# EAGLE design openDrive_LM3S6965_00.01 (EAGLE 5.10)
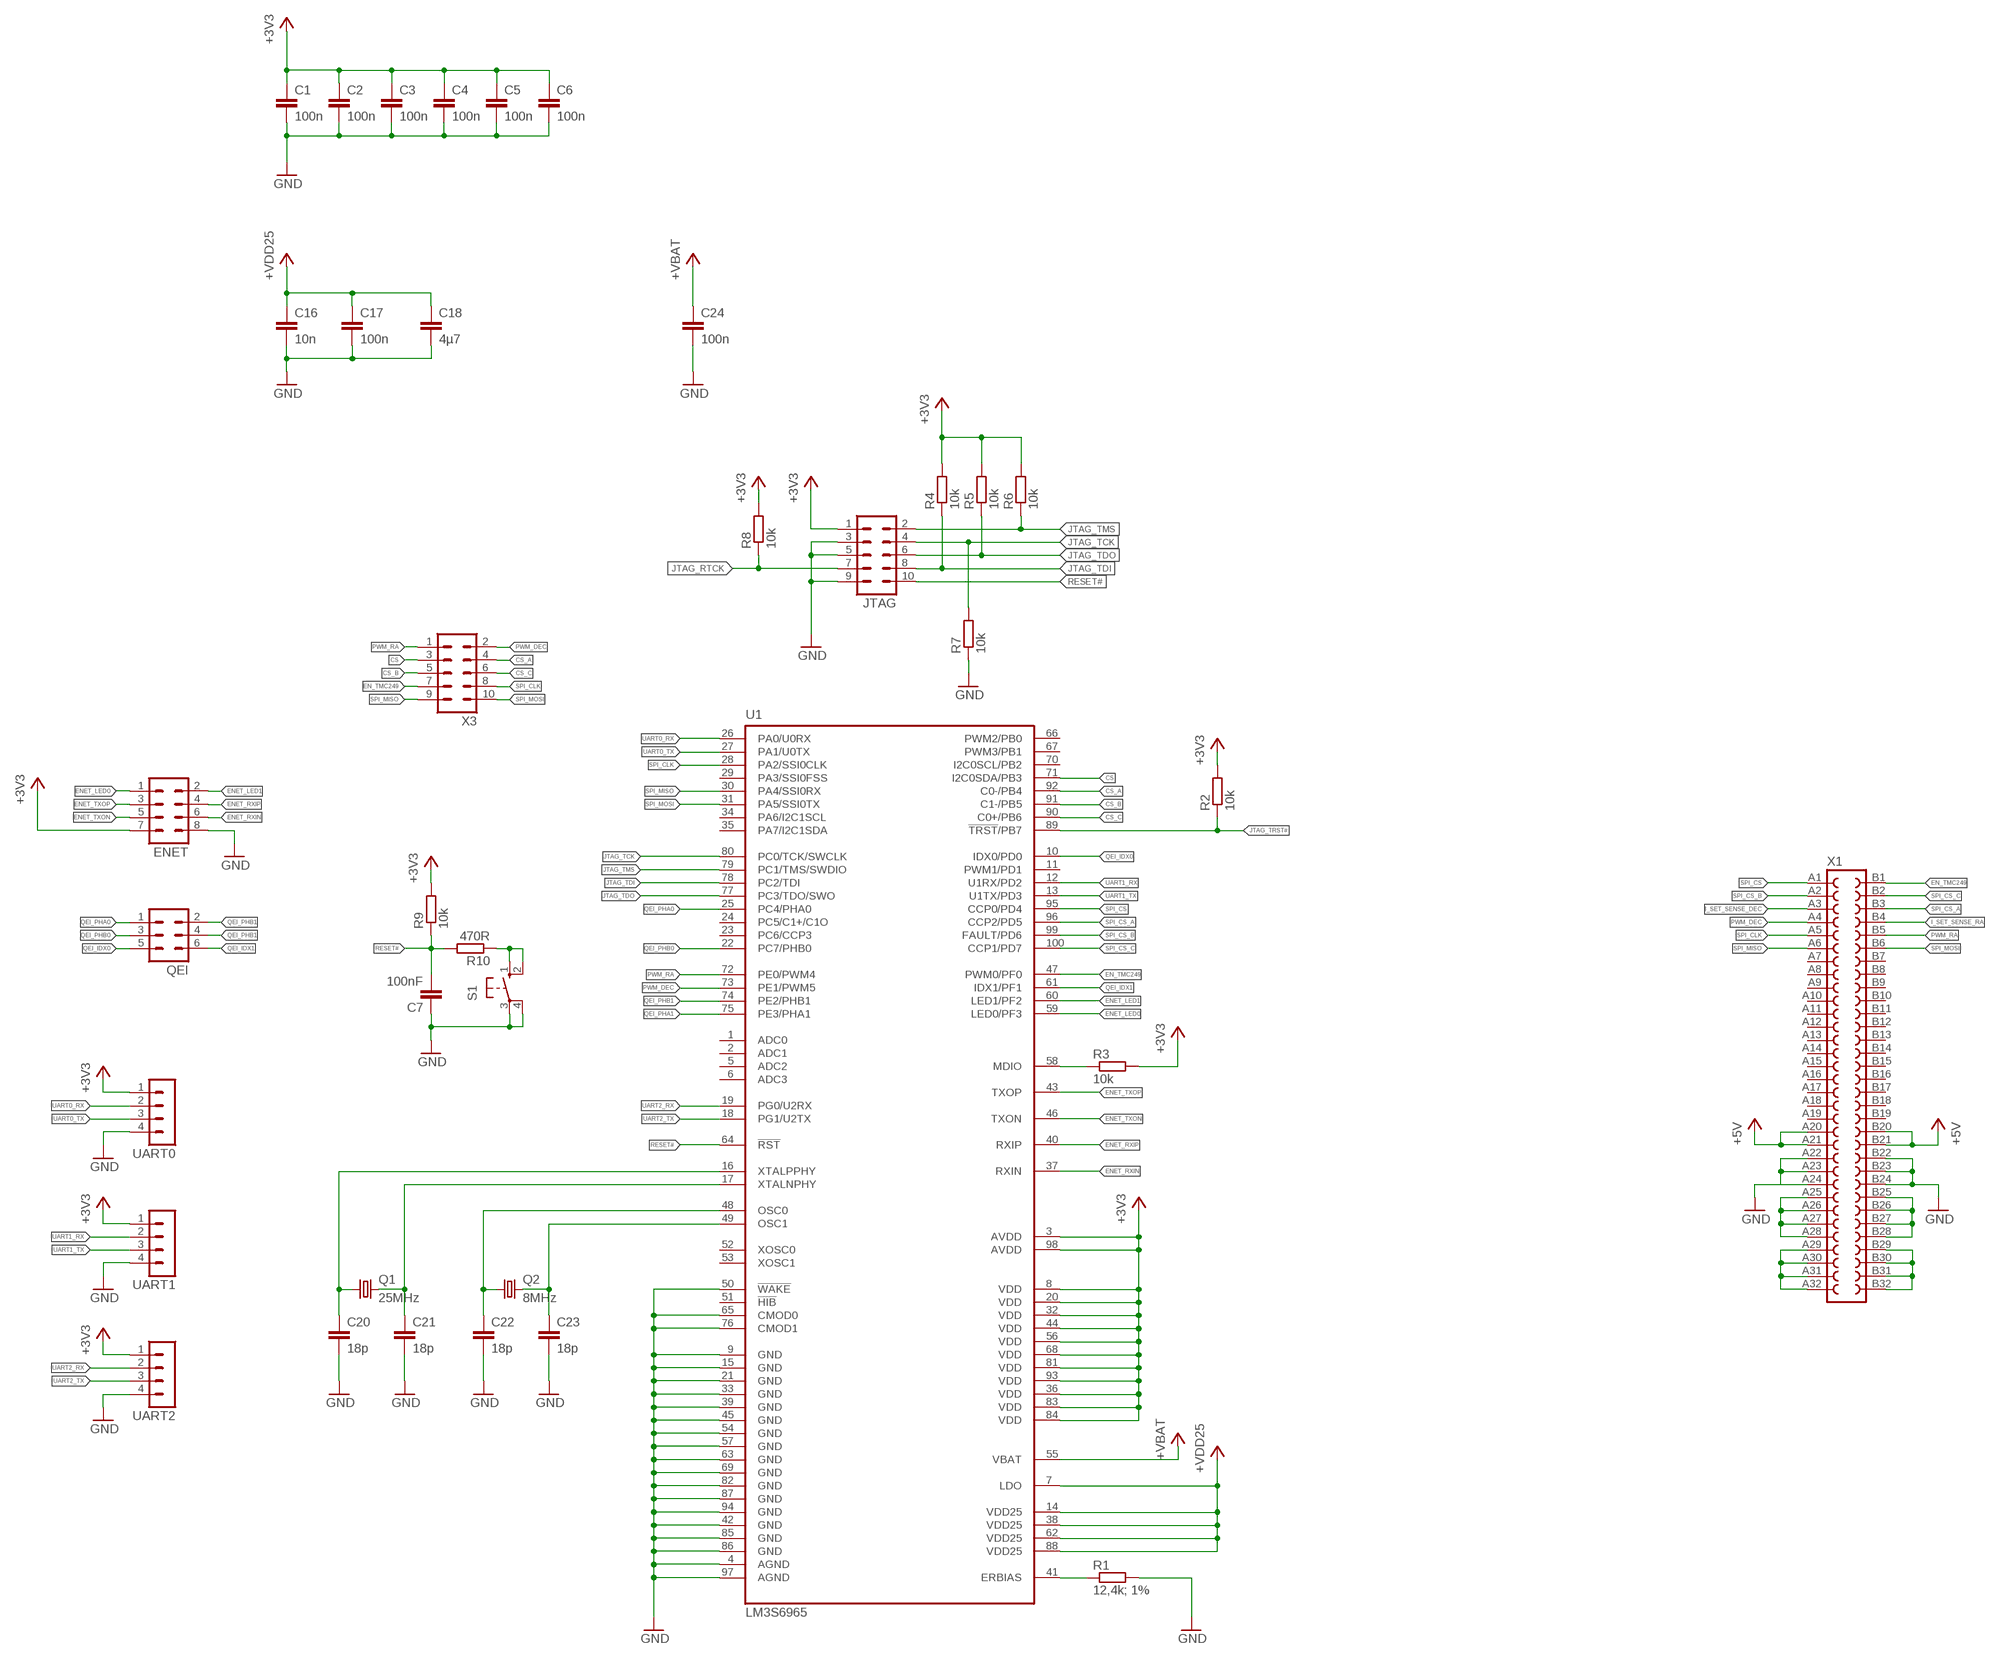
[diagram p0: schematic, sheet 1]

## Parts
C1  100n  C-EU025-025X050  [C025-025X050]
C2  100n  C-EU025-025X050  [C025-025X050]
C3  100n  C-EU025-025X050  [C025-025X050]
C4  100n  C-EU025-025X050  [C025-025X050]
C5  100n  C-EU025-025X050  [C025-025X050]
C6  100n  C-EU025-025X050  [C025-025X050]
C7  100nF  C-EU025-025X050  [C025-025X050]
C16  10n  C-EU025-025X050  [C025-025X050]
C17  100n  C-EU025-025X050  [C025-025X050]
C18  4µ7  C-EU025-025X050  [C025-025X050]
C20  18p  C-EU025-025X050  [C025-025X050]
C21  18p  C-EU025-025X050  [C025-025X050]
C22  18p  C-EU025-025X050  [C025-025X050]
C23  18p  C-EU025-025X050  [C025-025X050]
C24  100n  C-EU025-025X050  [C025-025X050]
ENET  MA04-2  [MA04-2]
JTAG  ML10  [ML10]
Q1  25MHz  CRYSTALHC49S  [HC49/S]
Q2  8MHz  CRYSTALHC49S  [HC49/S]
QEI  ML6  [ML6]
R1  12,4k; 1%  R-EU_0207/10  [0207/10]
R2  10k  R-EU_0207/10  [0207/10]
R3  10k  R-EU_0207/10  [0207/10]
R4  10k  R-EU_0207/10  [0207/10]
R5  10k  R-EU_0207/10  [0207/10]
R6  10k  R-EU_0207/10  [0207/10]
R7  10k  R-EU_0207/10  [0207/10]
R8  10k  R-EU_0207/10  [0207/10]
R9  10k  R-EU_0207/10  [0207/10]
R10  470R  R-EU_0207/10  [0207/10]
S1  10-XX  [B3F-10XX]
U1  LM3S6965  [LQFP100]
UART0  MA04-1  [MA04-1]
UART1  MA04-1  [MA04-1]
UART2  MA04-1  [MA04-1]
X1  FAB64S  [FAB64S]
X3  ML10  [ML10]

## Nets
+3V3: C1.1 C2.1 C3.1 C4.1 C5.1 C6.1 ENET.7 JTAG.1 R2.2 R3.2 R4.2 R5.2 R6.2 R8.2 R9.2 U1.3(AVDD) U1.8(VDD) U1.20(VDD) U1.32(VDD) U1.36(VDD) U1.44(VDD) U1.56(VDD) U1.68(VDD) U1.81(VDD) U1.83(VDD) U1.84(VDD) U1.93(VDD) U1.98(AVDD) UART0.1 UART1.1 UART2.1
+5V: X1.A20 X1.A21 X1.B20 X1.B21
+30V: X1.A29 X1.A30 X1.A31 X1.A32 X1.B29 X1.B30 X1.B31 X1.B32
+VBAT: C24.1 U1.55(VBAT)
+VDD25: C16.1 C17.1 C18.1 U1.7(LDO) U1.14(VDD25) U1.38(VDD25) U1.62(VDD25) U1.88(VDD25)
AGND: X1.A25 X1.A26 X1.A27 X1.A28 X1.B25 X1.B26 X1.B27 X1.B28
CS: U1.71(I2C0SDA/PB3) X3.3
CS_A: U1.92(C0-/PB4) X3.4
CS_B: U1.91(C1-/PB5) X3.5
CS_C: U1.90(C0+/PB6) X3.6
EN_TMC249: U1.47(PWM0/PF0) X1.B1 X3.7
ENET_LED0: ENET.1 U1.59(LED0/PF3)
ENET_LED1: ENET.2 U1.60(LED1/PF2)
ENET_RXIN: ENET.6 U1.37(RXIN)
ENET_RXIP: ENET.4 U1.40(RXIP)
ENET_TXON: ENET.5 U1.46(TXON)
ENET_TXOP: ENET.3 U1.43(TXOP)
GND: C1.2 C2.2 C3.2 C4.2 C5.2 C6.2 C7.1 C16.2 C17.2 C18.2 C20.2 C21.2 C22.2 C23.2 C24.2 ENET.8 JTAG.3 JTAG.5 JTAG.9 R1.2 R7.1 S1.3(P) S1.4(P1) U1.4(AGND) U1.9(GND) U1.15(GND) U1.21(GND) U1.33(GND) U1.39(GND) U1.42(GND) U1.45(GND) U1.50(!WAKE!) U1.54(GND) U1.57(GND) U1.63(GND) U1.65(CMOD0) U1.69(GND) U1.76(CMOD1) U1.82(GND) U1.85(GND) U1.86(GND) U1.87(GND) U1.94(GND) U1.97(AGND) UART0.4 UART1.4 UART2.4 X1.A22 X1.A23 X1.A24 X1.B22 X1.B23 X1.B24
I_SET_SENSE_DEC: X1.A3
I_SET_SENSE_RA: X1.B4
JTAG_RTCK: JTAG.7 R8.1
JTAG_TCK: JTAG.4 R7.2 U1.80(PC0/TCK/SWCLK)
JTAG_TDI: JTAG.8 R4.1 U1.78(PC2/TDI)
JTAG_TDO: JTAG.6 R5.1 U1.77(PC3/TDO/SWO)
JTAG_TMS: JTAG.2 R6.1 U1.79(PC1/TMS/SWDIO)
JTAG_TRST#: R2.1 U1.89(!TRST!/PB7)
N$1: C20.1 Q1.1 U1.16(XTALPPHY)
N$2: C21.1 Q1.2 U1.17(XTALNPHY)
N$3: C22.1 Q2.1 U1.48(OSC0)
N$4: C23.1 Q2.2 U1.49(OSC1)
N$5: R1.1 U1.41(ERBIAS)
N$6: R3.1 U1.58(MDIO)
N$7: R10.1 S1.1(S) S1.2(S1)
PWM_DEC: U1.73(PE1/PWM5) X1.A4 X3.2
PWM_RA: U1.72(PE0/PWM4) X1.B5 X3.1
QEI_IDX0: QEI.5 U1.10(IDX0/PD0)
QEI_IDX1: QEI.6 U1.61(IDX1/PF1)
QEI_PHA0: QEI.1 U1.25(PC4/PHA0)
QEI_PHA1: U1.75(PE3/PHA1)
QEI_PHB0: QEI.3 U1.22(PC7/PHB0)
QEI_PHB1: QEI.2 QEI.4 U1.74(PE2/PHB1)
RESET#: C7.2 JTAG.10 R9.1 R10.2 U1.64(!RST!)
SPI_CLK: U1.28(PA2/SSI0CLK) X1.A5 X3.8
SPI_CS: U1.95(CCP0/PD4) X1.A1
SPI_CS_A: U1.96(CCP2/PD5) X1.B3
SPI_CS_B: U1.99(FAULT/PD6) X1.A2
SPI_CS_C: U1.100(CCP1/PD7) X1.B2
SPI_MISO: U1.30(PA4/SSI0RX) X1.A6 X3.9
SPI_MOSI: U1.31(PA5/SSI0TX) X1.B6 X3.10
UART0_RX: U1.26(PA0/U0RX) UART0.2
UART0_TX: U1.27(PA1/U0TX) UART0.3
UART1_RX: U1.12(U1RX/PD2) UART1.2
UART1_TX: U1.13(U1TX/PD3) UART1.3
UART2_RX: U1.19(PG0/U2RX) UART2.2
UART2_TX: U1.18(PG1/U2TX) UART2.3
Unconnected: U1.1(ADC0) U1.2(ADC1) U1.5(ADC2) U1.6(ADC3) U1.11(PWM1/PD1) U1.23(PC6/CCP3) U1.24(PC5/C1+/C1O) U1.29(PA3/SSI0FSS) U1.34(PA6/I2C1SCL) U1.35(PA7/I2C1SDA) U1.51(!HIB!) U1.52(XOSC0) U1.53(XOSC1) U1.66(PWM2/PB0) U1.67(PWM3/PB1) U1.70(I2C0SCL/PB2) X1.A7 X1.A8 X1.A9 X1.A10 X1.A11 X1.A12 X1.A13 X1.A14 X1.A15 X1.A16 X1.A17 X1.A18 X1.A19 X1.B7 X1.B8 X1.B9 X1.B10 X1.B11 X1.B12 X1.B13 X1.B14 X1.B15 X1.B16 X1.B17 X1.B18 X1.B19

## Library data of the parts
C1-C7 C16-C18 C20-C24 = rcl:C-EU: CAPACITOR, European symbol
ENET = con-lstb:MA04-2: PIN HEADER
JTAG X3 = con-harting-ml:ML10: HARTING
Q1 Q2 = crystal:CRYSTAL: CRYSTAL
QEI = con-harting-ml:ML6: HARTING
R1-R10 = rcl:R-EU_: RESISTOR, European symbol
S1 = switch-omron:10-XX: OMRON SWITCH
U1 = luminary-arm:LM3S6965: MICROCONTROLLER
UART0 UART1 UART2 = con-lstb:MA04-1: PIN HEADER
X1 = con-vg:FAB64S: CONNECTOR female, 64 pins, block, type B, rows AB, grid 2.54 mm

## Board
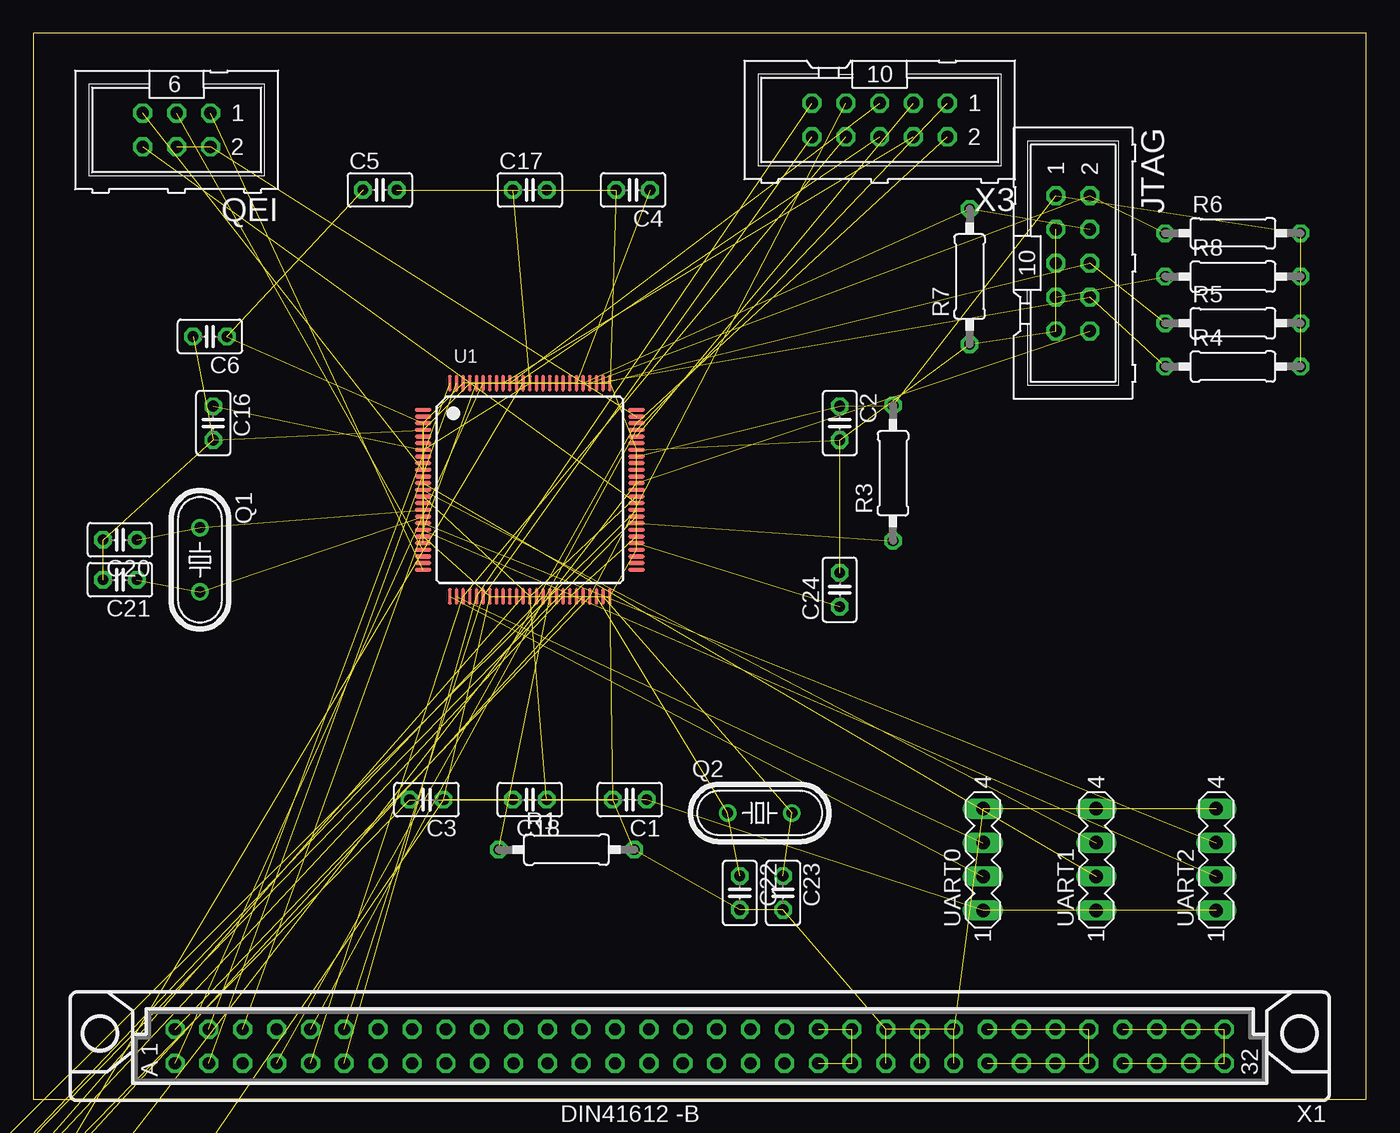
[diagram p1: board, top side]
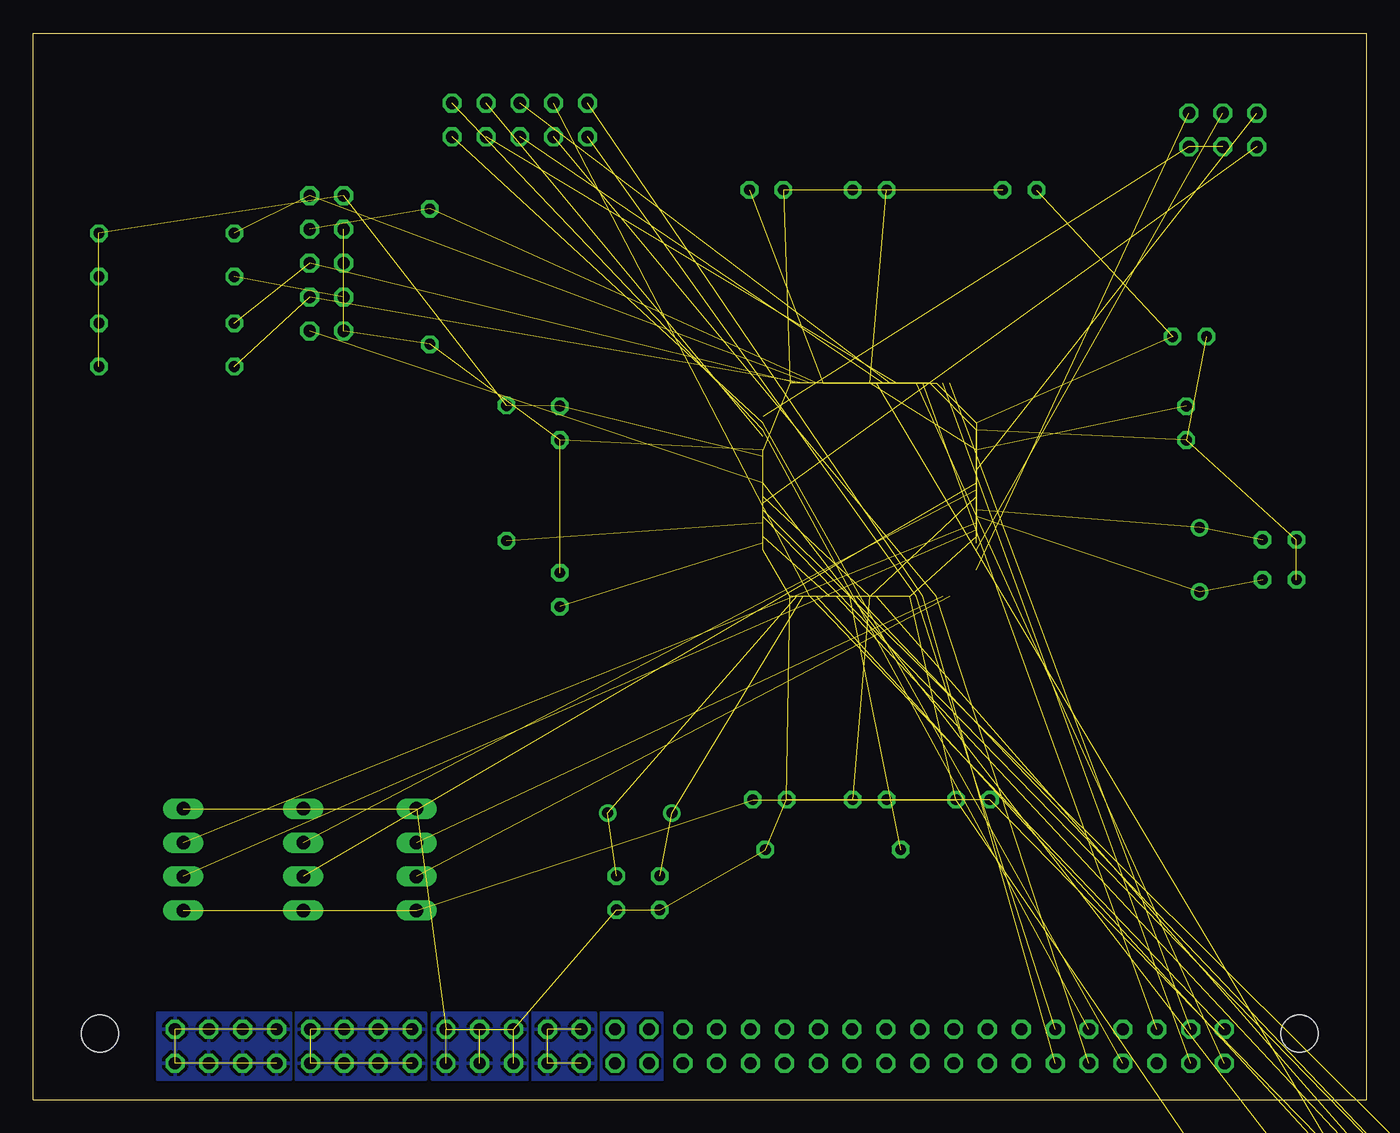
[diagram p2: board, bottom side, seen from below]

Size 100 x 80 mm. Coordinates in mm from the lower left corner, seen from the top.
Outline: 100,0 100,80 0,80 0,0 100,0
Copper layers (1*16): Top 0.035mm / dielectric 1.5mm / Bottom 0.035mm
Design rules "default": minimum track width 10mil, minimum drill 24mil, track to track 8mil, track to pad 8mil, pad to pad 8mil, via to via 8mil, smd to smd 8mil, copper to edge 40mil, drill to drill 8mil, minimum pad ring 10mil, minimum via ring 8mil, stop-mask expansion 4mil, vias tented up to drill 0mil, thermal gap 10mil

### Footprints (pad centres in the part's own frame; a part is rotated, then mirrored left to right if it is on the bottom)
C025-025X050 = drill 0.813 octagon: 1 -1.27,0; 2 1.27,0
MA04-2 = drill 1.016 octagon: 1 -3.81,-1.27; 2 -3.81,1.27; 3 -1.27,-1.27; 4 -1.27,1.27; 5 1.27,-1.27; 6 1.27,1.27; 7 3.81,-1.27; 8 3.81,1.27
ML10 = drill 0.914 octagon: 1 -5.08,-1.27; 2 -5.08,1.27; 3 -2.54,-1.27; 4 -2.54,1.27; 5 0,-1.27; 6 0,1.27; 7 2.54,-1.27; 8 2.54,1.27; 9 5.08,-1.27; 10 5.08,1.27
HC49/S = drill 0.813 round: 1 -2.413,0; 2 2.413,0
ML6 = drill 0.914 octagon: 1 -2.54,-1.27; 2 -2.54,1.27; 3 0,-1.27; 4 0,1.27; 5 2.54,-1.27; 6 2.54,1.27
0207/10 = drill 0.813 octagon: 1 -5.08,0; 2 5.08,0
B3F-10XX = drill 1.016 long: 1 -3.251,2.261; 2 3.251,2.261; 3 -3.251,-2.261; 4 3.251,-2.261
LQFP100 = smd 0.3 x 1.25: 1 -6,-8; 2 -5.5,-8; 3 -5,-8; 4 -4.5,-8; 5 -4,-8; 6 -3.5,-8; 7 -3,-8; 8 -2.5,-8; 9 -2,-8; 10 -1.5,-8; 11 -1,-8; 12 -0.5,-8; 13 0,-8; 14 0.5,-8; 15 1,-8; 16 1.5,-8; 17 2,-8; 18 2.5,-8; 19 3,-8; 20 3.5,-8; 21 4,-8; 22 4.5,-8; 23 5,-8; 24 5.5,-8; 25 6,-8; 51 6,8; 52 5.5,8; 53 5,8; 54 4.5,8; 55 4,8; 56 3.5,8; 57 3,8; 58 2.5,8; 59 2,8; 60 1.5,8; 61 1,8; 62 0.5,8; 63 0,8; 64 -0.5,8; 65 -1,8; 66 -1.5,8; 67 -2,8; 68 -2.5,8; 69 -3,8; 70 -3.5,8; 71 -4,8; 72 -4.5,8; 73 -5,8; 74 -5.5,8; 75 -6,8 | smd 1.25 x 0.3: 26 8,-6; 27 8,-5.5; 28 8,-5; 29 8,-4.5; 30 8,-4; 31 8,-3.5; 32 8,-3; 33 8,-2.5; 34 8,-2; 35 8,-1.5; 36 8,-1; 37 8,-0.5; 38 8,0; 39 8,0.5; 40 8,1; 41 8,1.5; 42 8,2; 43 8,2.5; 44 8,3; 45 8,3.5; 46 8,4; 47 8,4.5; 48 8,5; 49 8,5.5; 50 8,6; 76 -8,6; 77 -8,5.5; 78 -8,5; 79 -8,4.5; 80 -8,4; 81 -8,3.5; 82 -8,3; 83 -8,2.5; 84 -8,2; 85 -8,1.5; 86 -8,1; 87 -8,0.5; 88 -8,0; 89 -8,-0.5; 90 -8,-1; 91 -8,-1.5; 92 -8,-2; 93 -8,-2.5; 94 -8,-3; 95 -8,-3.5; 96 -8,-4; 97 -8,-4.5; 98 -8,-5; 99 -8,-5.5; 100 -8,-6
MA04-1 = drill 1.016 long: 1 -3.81,0; 2 -1.27,0; 3 1.27,0; 4 3.81,0
FAB64S = drill 0.914 octagon: A1 -1.27,39.37; A2 -1.27,36.83; A3 -1.27,34.29; A4 -1.27,31.75; A5 -1.27,29.21; A6 -1.27,26.67; A7 -1.27,24.13; A8 -1.27,21.59; A9 -1.27,19.05; A10 -1.27,16.51; A11 -1.27,13.97; A12 -1.27,11.43; A13 -1.27,8.89; A14 -1.27,6.35; A15 -1.27,3.81; A16 -1.27,1.27; A17 -1.27,-1.27; A18 -1.27,-3.81; A19 -1.27,-6.35; A20 -1.27,-8.89; A21 -1.27,-11.43; A22 -1.27,-13.97; A23 -1.27,-16.51; A24 -1.27,-19.05; A25 -1.27,-21.59; A26 -1.27,-24.13; A27 -1.27,-26.67; A28 -1.27,-29.21; A29 -1.27,-31.75; A30 -1.27,-34.29; A31 -1.27,-36.83; A32 -1.27,-39.37; B1 1.27,39.37; B2 1.27,36.83; B3 1.27,34.29; B4 1.27,31.75; B5 1.27,29.21; B6 1.27,26.67; B7 1.27,24.13; B8 1.27,21.59; B9 1.27,19.05; B10 1.27,16.51; B11 1.27,13.97; B12 1.27,11.43; B13 1.27,8.89; B14 1.27,6.35; B15 1.27,3.81; B16 1.27,1.27; B17 1.27,-1.27; B18 1.27,-3.81; B19 1.27,-6.35; B20 1.27,-8.89; B21 1.27,-11.43; B22 1.27,-13.97; B23 1.27,-16.51; B24 1.27,-19.05; B25 1.27,-21.59; B26 1.27,-24.13; B27 1.27,-26.67; B28 1.27,-29.21; B29 1.27,-31.75; B30 1.27,-34.29; B31 1.27,-36.83; B32 1.27,-39.37 | hole 2.794: 0.965,-45.009; 0.965,45.009

### Placement (x,y rotation side)
C1  44.75,22.5 180 top
C2  60.5,50.75 270 top
C3  29.5,22.5 180 top
C4  45,68.25 180 top
C5  26,68.25 0 top
C6  13.25,57.25 180 top
C7  -14.75,-9.25 0 top  (outside the outline)
C16  13.5,50.75 270 top
C17  37.25,68.25 0 top
C18  37.25,22.5 180 top
C20  6.5,42 180 top
C21  6.5,39 180 top
C22  53,15.5 270 top
C23  56.25,15.5 270 top
C24  60.5,38.25 90 top
ENET  -12.25,-18 0 top  (outside the outline)
JTAG  78,62.75 270 top
Q1  12.5,40.5 270 top
Q2  54.5,21.5 0 top
QEI  10.75,72.75 180 top
R1  40,18.75 0 top
R2  6.25,-6 0 top  (outside the outline)
R3  64.5,47 90 top
R4  90,55 0 top
R5  90,58.25 0 top
R6  90,65 0 top
R7  70.25,61.75 90 top
R8  90,61.75 0 top
R9  6,-11 0 top  (outside the outline)
R10  -11.75,-26.25 0 top  (outside the outline)
S1  -6,-7 0 top  (outside the outline)
U1  37.25,45.75 270 top
UART0  71.25,18 90 top
UART1  79.75,18 90 top
UART2  88.75,18 90 top
X1  50,4 90 top
X3  63.5,73.5 180 top

### Tracks (layer width: path | path; a pad name or v marks a point on that pad's centre or on a via)
+3V3  (30 unrouted)
  pour Bottom (rank 5): 56.5,1.5 52.75,1.5 52.75,6.5 57.62,6.5 57.62,1.5
+5V  (3 unrouted)
  pour Bottom (rank 4): 61.75,1.5 57.75,1.5 57.75,6.5 62.62,6.5 62.62,1.5
+30V  (7 unrouted)
  pour Bottom: 90.75,1.5 80.62,1.5 80.62,6.5 90.75,6.5
+VBAT  (1 unrouted)
+VDD25  (7 unrouted)
AGND  (7 unrouted)
  pour Bottom (rank 2): 80.5,1.5 70.5,1.5 70.5,6.5 80.5,6.5
CS  (1 unrouted)
CS_A  (1 unrouted)
CS_B  (1 unrouted)
CS_C  (1 unrouted)
EN_TMC249  (2 unrouted)
ENET_LED0  (1 unrouted)
ENET_LED1  (1 unrouted)
ENET_RXIN  (1 unrouted)
ENET_RXIP  (1 unrouted)
ENET_TXON  (1 unrouted)
ENET_TXOP  (1 unrouted)
GND  (52 unrouted)
  pour Bottom (isolate 0.254, rank 3): 69,1.5 62.88,1.5 62.88,6.5 70.12,6.5 70.12,1.5
JTAG_RTCK  (1 unrouted)
JTAG_TCK  (2 unrouted)
JTAG_TDI  (2 unrouted)
JTAG_TDO  (2 unrouted)
JTAG_TMS  (2 unrouted)
JTAG_TRST#  (1 unrouted)
N$1  (2 unrouted)
N$2  (2 unrouted)
N$3  (2 unrouted)
N$4  (2 unrouted)
N$5  (1 unrouted)
N$6  (1 unrouted)
N$7  (2 unrouted)
PWM_DEC  (2 unrouted)
PWM_RA  (2 unrouted)
QEI_IDX0  (1 unrouted)
QEI_IDX1  (1 unrouted)
QEI_PHA0  (1 unrouted)
QEI_PHB0  (1 unrouted)
QEI_PHB1  (2 unrouted)
RESET#  (4 unrouted)
SPI_CLK  (2 unrouted)
SPI_CS  (1 unrouted)
SPI_CS_A  (1 unrouted)
SPI_CS_B  (1 unrouted)
SPI_CS_C  (1 unrouted)
SPI_MISO  (2 unrouted)
SPI_MOSI  (2 unrouted)
UART0_RX  (1 unrouted)
UART0_TX  (1 unrouted)
UART1_RX  (1 unrouted)
UART1_TX  (1 unrouted)
UART2_RX  (1 unrouted)
UART2_TX  (1 unrouted)